# EAGLE schematic atmega16 (EAGLE 7.1.0)
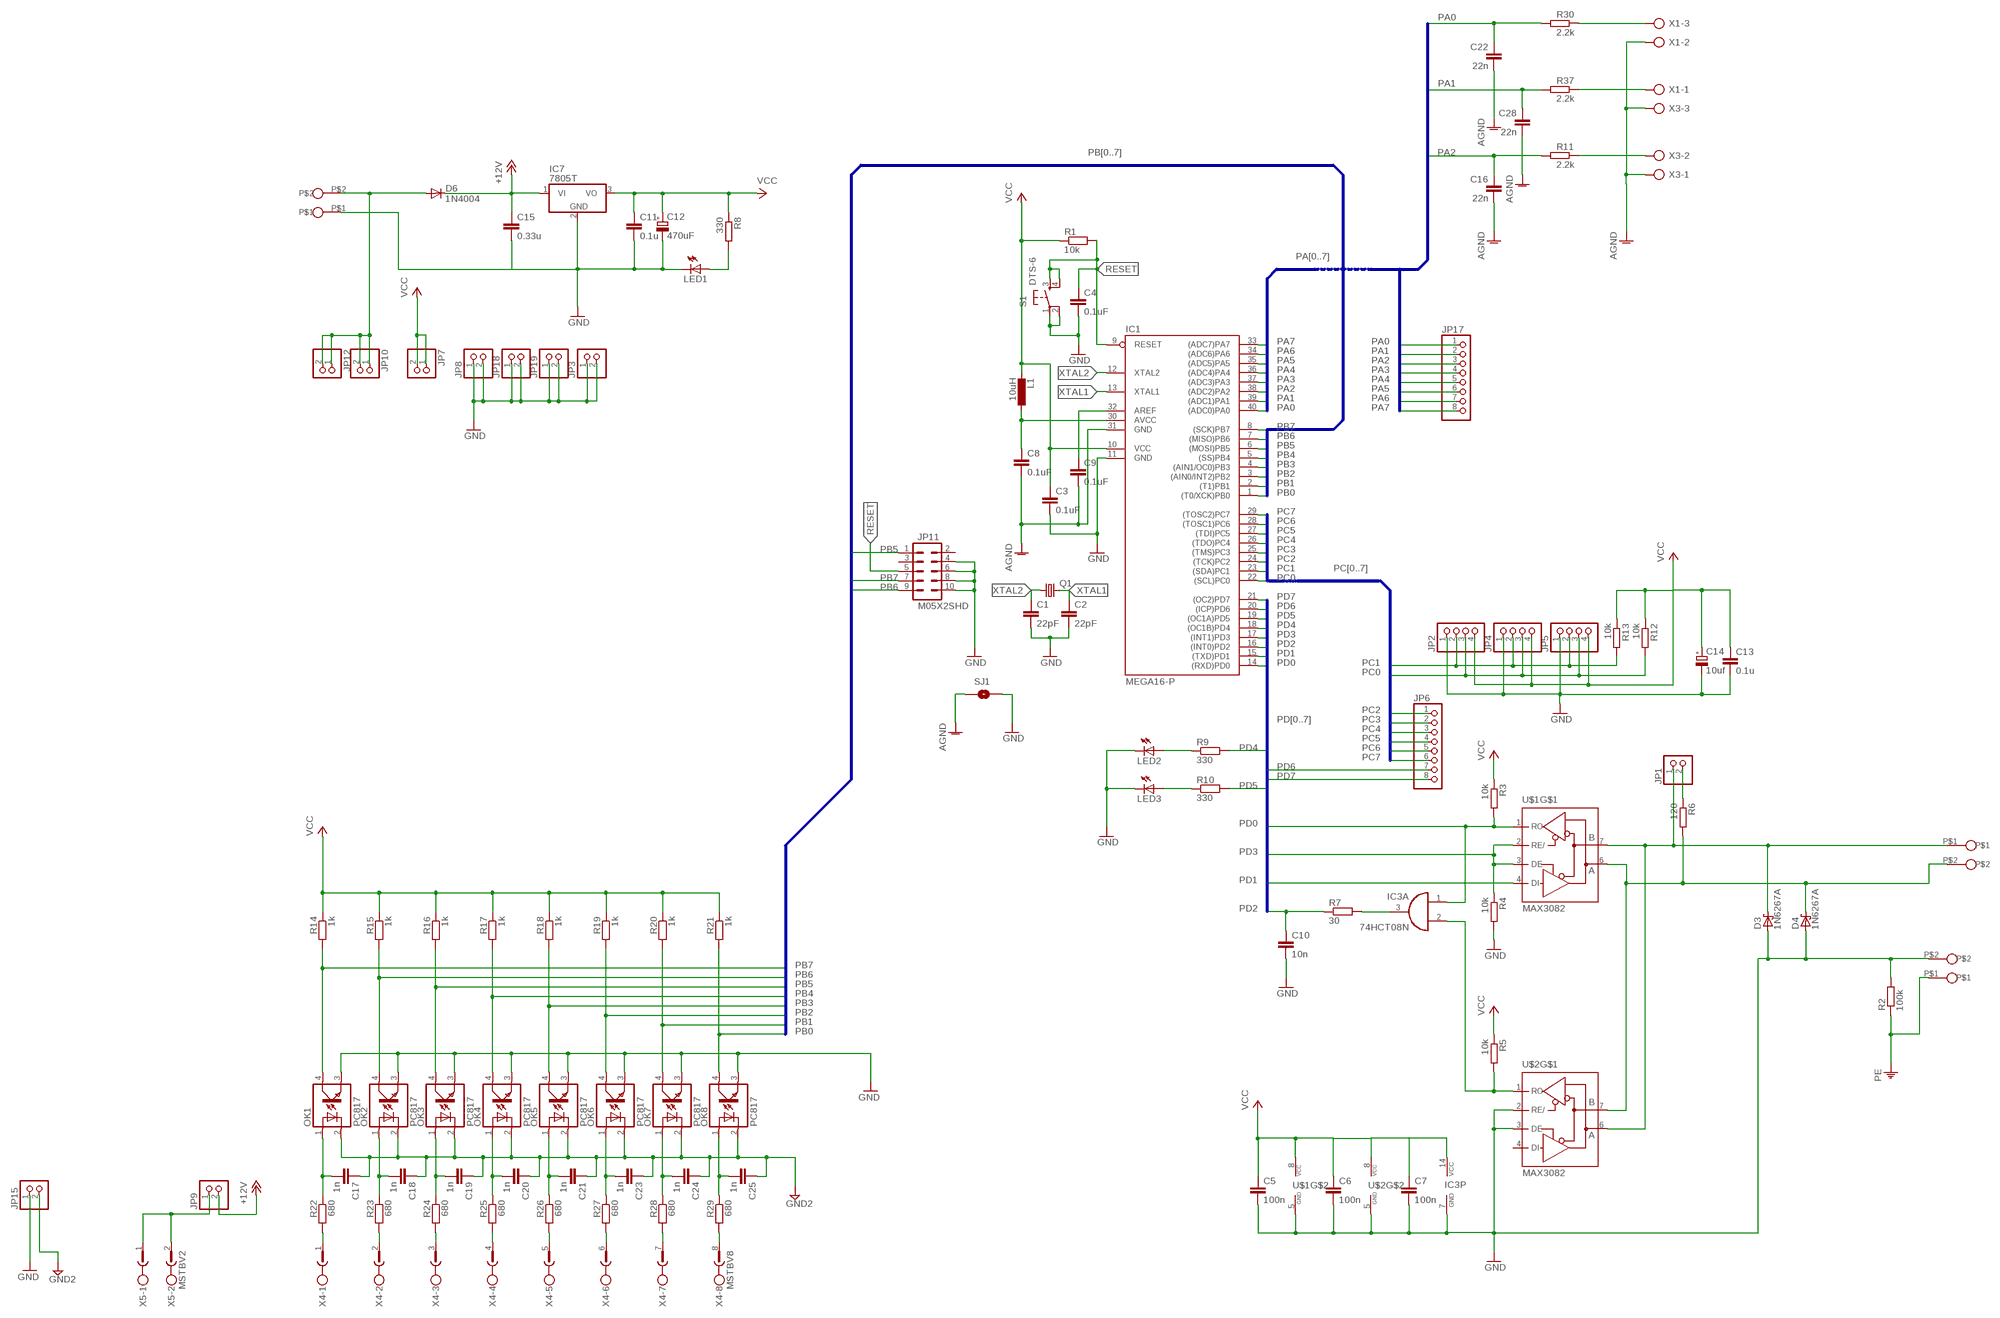
[diagram p0: schematic, sheet 1]

## Parts
C1  22pF  C-EU050-024X044  [C050-024X044]
C2  22pF  C-EU050-024X044  [C050-024X044]
C3  0.1uF  C-EU050-025X075  [C050-025X075]
C4  0.1uF  C-EU050-025X075  [C050-025X075]
C5  100n  C-EU050-035X075  [C050-035X075]
C6  100n  C-EU050-035X075  [C050-035X075]
C7  100n  C-EU050-035X075  [C050-035X075]
C8  0.1uF  C-EU050-025X075  [C050-025X075]
C9  0.1uF  C-EU050-025X075  [C050-025X075]
C10  10n  C-EU050-035X075  [C050-035X075]
C11  0.1u  C-EU025-024X044  [C025-024X044]
C12  470uF  CPOL-EUE5-10.5  [E5-10,5]
C13  0.1u  C-EU025-024X044  [C025-024X044]
C14  10uf  CPOL-EUE2-4  [E2-4]
C15  0.33u  C-EU025-024X044  [C025-024X044]
C16  22n  C-EU050-025X075  [C050-025X075]
C17  1n  C-EU050-025X075  [C050-025X075]
C18  1n  C-EU050-025X075  [C050-025X075]
C19  1n  C-EU050-025X075  [C050-025X075]
C20  1n  C-EU050-025X075  [C050-025X075]
C21  1n  C-EU050-025X075  [C050-025X075]
C22  22n  C-EU050-025X075  [C050-025X075]
C23  1n  C-EU050-025X075  [C050-025X075]
C24  1n  C-EU050-025X075  [C050-025X075]
C25  1n  C-EU050-025X075  [C050-025X075]
C28  22n  C-EU050-025X075  [C050-025X075]
D3  1N6267A  [C4111-15]
D4  1N6267A  [C4111-15]
D6  1N4004  [DO41-10]
IC1  MEGA16-P  [DIL40]
IC3  74HCT08N  [DIL14]
IC7  7805T  [TO220H]
JP1  PINHD-1X2  [1X02]
JP2  PINHD-1X4  [1X04]
JP3  PINHD-1X2  [1X02]
JP4  PINHD-1X4  [1X04]
JP5  PINHD-1X4  [1X04]
JP6  PINHD-1X8  [1X08]
JP7  PINHD-1X2  [1X02]
JP8  PINHD-1X2  [1X02]
JP9  PINHD-1X2  [1X02]
JP10  PINHD-1X2  [1X02]
JP11  M05X2SHD  [2X5-SHROUDED]
JP12  PINHD-1X2  [1X02]
JP15  PINHD-1X2  [1X02]
JP17  PINHD-1X8  [1X08]
JP18  PINHD-1X2  [1X02]
JP19  PINHD-1X2  [1X02]
L1  10uH  L-EU0207/12  [0207/12]
LED1  LED3MM  [LED3MM]
LED2  LED3MM  [LED3MM]
LED3  LED3MM  [LED3MM]
OK1  PC817  [DIL04]
OK2  PC817  [DIL04]
OK3  PC817  [DIL04]
OK4  PC817  [DIL04]
OK5  PC817  [DIL04]
OK6  PC817  [DIL04]
OK7  PC817  [DIL04]
OK8  PC817  [DIL04]
Q1  CRYSTALHC49U70  [HC49U70]
R1  10k  R-EU_0204/7  [0204/7]
R2  100k  R-EU_0204/7  [0204/7]
R3  10k  R-EU_0204/7  [0204/7]
R4  10k  R-EU_0204/7  [0204/7]
R5  10k  R-EU_0204/7  [0204/7]
R6  120  R-EU_0204/7  [0204/7]
R7  30  R-EU_0207/10  [0207/10]
R8  330  R-EU_0204/7  [0204/7]
R9  330  R-EU_0204/7  [0204/7]
R10  330  R-EU_0204/7  [0204/7]
R11  2.2k  R-EU_0204/7  [0204/7]
R12  10k  R-EU_0204/7  [0204/7]
R13  10k  R-EU_0204/7  [0204/7]
R14  1k  R-EU_0204/7  [0204/7]
R15  1k  R-EU_0204/7  [0204/7]
R16  1k  R-EU_0204/7  [0204/7]
R17  1k  R-EU_0204/7  [0204/7]
R18  1k  R-EU_0204/7  [0204/7]
R19  1k  R-EU_0204/7  [0204/7]
R20  1k  R-EU_0204/7  [0204/7]
R21  1k  R-EU_0204/7  [0204/7]
R22  680  R-EU_0204/7  [0204/7]
R23  680  R-EU_0204/7  [0204/7]
R24  680  R-EU_0204/7  [0204/7]
R25  680  R-EU_0204/7  [0204/7]
R26  680  R-EU_0204/7  [0204/7]
R27  680  R-EU_0204/7  [0204/7]
R28  680  R-EU_0204/7  [0204/7]
R29  680  R-EU_0204/7  [0204/7]
R30  2.2k  R-EU_0204/7  [0204/7]
R37  2.2k  R-EU_0204/7  [0204/7]
S1  DTS-6  [DTS-6]
SJ1  SOLDERJUMPERTRACE  [SJ_2S-TRACE]
U$1  MAX3082  [DIL08]
U$2  MAX3082  [DIL08]
U$3  TM-2  [CON-2]
U$4  TM-2  [CON-2]
U$5  TM-2  [CON-2]
X1  AK500/3  [AK500/3]
X3  AK500/3  [AK500/3]
X4  MSTBV8  [MSTBV8]
X5  MSTBV2  [MSTBV2]

## Nets
+12V: C15.1 D6.C IC7.1(VI) JP9.2
AGND: C8.2 C9.2 C16.2 C22.2 C28.2 IC1.31(GND) SJ1.1 X1.2 X3.1 X3.3
GND: C1.2 C2.2 C3.2 C4.2 C5.2 C6.2 C7.2 C10.2 C11.2 C12.- C13.2 C14.- C15.2 D3.A D4.A IC1.11(GND) IC3.7(P:GND) IC7.2(GND) JP2.1 JP3.1 JP3.2 JP4.1 JP5.1 JP8.1 JP8.2 JP11.4 JP11.6 JP11.8 JP11.10 JP15.1 JP18.1 JP18.2 JP19.1 JP19.2 LED1.K(C) LED2.K(C) LED3.K(C) OK1.3(EMIT) OK2.3(EMIT) OK3.3(EMIT) OK4.3(EMIT) OK5.3(EMIT) OK6.3(EMIT) OK7.3(EMIT) OK8.3(EMIT) R2.2 R4.2 S1.1 S1.2 SJ1.2 U$1.5(GND) U$2.2(RE/) U$2.3(DE) U$2.5(GND) U$4.P$2 U$5.P$1
GND2: C17.1 C18.1 C19.1 C20.1 C21.1 C23.1 C24.1 C25.1 JP15.2 OK1.2(C) OK2.2(C) OK3.2(C) OK4.2(C) OK5.2(C) OK6.2(C) OK7.2(C) OK8.2(C)
N$1: JP1.2 R6.1
N$2: D4.C R6.2 U$1.6(A) U$2.7(B) U$3.P$2
N$3: IC3.2(A:I1) R5.2 U$2.1(RO)
N$4: LED1.A R8.2
N$5: R30.1 X1.3
N$6: LED3.A R10.1
N$7: IC3.3(A:O) R7.2
N$8: C8.1 IC1.30(AVCC) L1.1
N$9: D3.C JP1.1 U$1.7(B) U$2.6(A) U$3.P$1
N$10: R37.1 X1.1
N$11: JP9.1 X5.1 X5.2
N$12: D6.A JP10.1 JP10.2 JP12.1 JP12.2 U$5.P$2
N$14: R11.1 X3.2
N$15: C9.1 IC1.32(AREF)
N$20: R22.2 X4.1
N$21: R26.2 X4.5
N$22: R27.2 X4.6
N$23: R28.2 X4.7
N$24: R29.2 X4.8
N$25: R23.2 X4.2
N$26: R24.2 X4.3
N$27: R25.2 X4.4
N$28: LED2.A R9.1
N$29: C17.2 OK1.1(A) R22.1
N$30: C18.2 OK2.1(A) R23.1
N$31: C19.2 OK3.1(A) R24.1
N$32: C20.2 OK4.1(A) R25.1
N$33: C21.2 OK5.1(A) R26.1
N$34: C23.2 OK6.1(A) R27.1
N$35: C24.2 OK7.1(A) R28.1
N$36: C25.2 OK8.1(A) R29.1
PA0: C22.1 IC1.40((ADC0)PA0) JP17.1 R30.2
PA1: C28.1 IC1.39((ADC1)PA1) JP17.2 R37.2
PA2: C16.1 IC1.38((ADC2)PA2) JP17.3 R11.2
PA3: IC1.37((ADC3)PA3) JP17.4
PA4: IC1.36((ADC4)PA4) JP17.5
PA5: IC1.35((ADC5)PA5) JP17.6
PA6: IC1.34((ADC6)PA6) JP17.7
PA7: IC1.33((ADC7)PA7) JP17.8
PB0: IC1.1((T0/XCK)PB0) OK8.4(COL) R21.2
PB1: IC1.2((T1)PB1) OK7.4(COL) R20.2
PB2: IC1.3((AIN0/INT2)PB2) OK6.4(COL) R19.2
PB3: IC1.4((AIN1/OC0)PB3) OK5.4(COL) R18.2
PB4: IC1.5((SS)PB4) OK4.4(COL) R17.2
PB5: IC1.6((MOSI)PB5) JP11.1 OK3.4(COL) R16.2
PB6: IC1.7((MISO)PB6) JP11.9 OK2.4(COL) R15.2
PB7: IC1.8((SCK)PB7) JP11.7 OK1.4(COL) R14.2
PC0: IC1.22((SCL)PC0) JP2.3 JP4.3 JP5.3 R12.2
PC1: IC1.23((SDA)PC1) JP2.2 JP4.2 JP5.2 R13.2
PC2: IC1.24((TCK)PC2) JP6.1
PC3: IC1.25((TMS)PC3) JP6.2
PC4: IC1.26((TDO)PC4) JP6.3
PC5: IC1.27((TDI)PC5) JP6.4
PC6: IC1.28((TOSC1)PC6) JP6.5
PC7: IC1.29((TOSC2)PC7) JP6.6
PD0: IC1.14((RXD)PD0) IC3.1(A:I0) R3.2 U$1.1(RO)
PD1: IC1.15((TXD)PD1) U$1.4(DI)
PD2: C10.1 IC1.16((INT0)PD2) R7.1
PD3: IC1.17((INT1)PD3) R4.1 U$1.2(RE/) U$1.3(DE)
PD4: IC1.18((OC1B)PD4) R9.2
PD5: IC1.19((OC1A)PD5) R10.2
PD6: IC1.20((ICP)PD6) JP6.7
PD7: IC1.21((OC2)PD7) JP6.8
PE: R2.1 U$4.P$1
RESET: C4.1 IC1.9(RESET) JP11.5 R1.2 S1.3 S1.4
VCC: C3.1 C5.1 C6.1 C7.1 C11.1 C12.+ C13.1 C14.+ IC1.10(VCC) IC3.14(P:VCC) IC7.3(VO) JP2.4 JP4.4 JP5.4 JP7.1 JP7.2 L1.2 R1.1 R3.1 R5.1 R8.1 R12.1 R13.1 R14.1 R15.1 R16.1 R17.1 R18.1 R19.1 R20.1 R21.1 U$1.8(VCC) U$2.8(VCC)
XTAL1: C2.1 IC1.13(XTAL1) Q1.2
XTAL2: C1.1 IC1.12(XTAL2) Q1.1
Unconnected: IC3.4(B:I0) IC3.5(B:I1) IC3.6(B:O) IC3.8(C:O) IC3.9(C:I0) IC3.10(C:I1) IC3.11(D:O) IC3.12(D:I0) IC3.13(D:I1) JP11.2 JP11.3 U$2.4(DI)

## Buses
PB[0..7]
PD[0..7]
PA[0..7]
PC[0..7]

## Library data of the parts
C1-C11 C13 C15-C25 C28 = rcl:C-EU: CAPACITOR, European symbol
C12 C14 = rcl:CPOL-EU: POLARIZED CAPACITOR, European symbol
D3 D4 = diode:1N6267A: DIODE transient voltage suppressor
D6 = diode:1N4004: DIODE general purpose rectifier, 1 A
IC1 = atmel:MEGA16-P: MICROCONTROLLER 16 Kbytes FLASH 1 kbytes SRAM 512 bytes EEPROM USART 8-channel 10 bit ADC Source: avr.lbr; MPN: ATMEGA16-16PU; OC_FARNELL: 9171142; OC_NEWARK: 01M6885
IC3 = 74xx-eu:74*08: Quad 2-input AND gate
IC7 = linear:78*: Positive VOLTAGE REGULATOR Source: http://cache.national.com/ds/LM/LM78L05.pdf http://www.fairchildsemi.com/ds/LM/LM7805.pdf
JP1 JP3 JP7-JP10 JP12 JP15 JP18 JP19 = pinhead:PINHD-1X2: PIN HEADER
JP2 JP4 JP5 = pinhead:PINHD-1X4: PIN HEADER
JP6 JP17 = pinhead:PINHD-1X8: PIN HEADER
JP11 = SparkFun:M05X2: Header 5x2 Standard 10-pin dual row 0.1" header. Commonly used with AVR-ISP. Use with Spark Fun Electronics SKU: PRT-00778
L1 = rcl:L-EU: INDUCTOR, European symbol
LED1-LED3 = led:LED: LED OSRAM: - CHIPLED LG R971, LG N971, LY N971, LG Q971, LY Q971, LO R971, LY R971 LH N974, LH R974 LS Q976, LO Q976, LY Q976 LO Q996 - Hyper CHIPLED LW Q18S LB Q993, LB Q99A, LB R99A - SideLED LS A670, LO A670, LY A670, LG A670, LP A670 LB A673, LV A673, LT A673, LW A673 LH A674 LY A675 LS A676, LA A676, LO A676, LY A676, LW A676 LS A679, LY A679, LG A679 - Hyper Micro SIDELED® LS Y876, LA Y876, LO Y876, LY Y876 LT Y87S - SmartLED LW L88C, LW L88S LB L89C, LB L89S, LG L890 LS L89K, LO L89K, LY L89K LS L896, LA L896, LO L896, LY L896 - TOPLED LS T670, LO T670, LY T670, LG T670, LP T670 LSG T670, LSP T670, LSY T670, LOP T670, LYG T670 LG T671, LOG T671, LSG T671 LB T673, LV T673, LT T673, LW T673 LH T674 LS T676, LA T676, LO T676, LY T676, LB T676, LH T676, LSB T676, LW T676 LB T67C, LV T67C, LT T67C, LS T67K, LO T67K, LY T67K, LW E67C LS E67B, LA E67B, LO E67B, LY E67B, LB E67C, LV E67C, LT E67C LW T67C LS T679, LY T679, LG T679 LS T770, LO T770, LY T770, LG T770, LP T770 LB T773, LV T773, LT T773, LW T773 LH T774 LS E675, LA E675, LY E675, LS T675 LS T776, LA T776, LO T776, LY T776, LB T776 LHGB T686 LT T68C, LB T68C - Hyper Mini TOPLED® LB M676 - Mini TOPLED Santana® LG M470 LS M47K, LO M47K, LY M47K Source: http://www.osram.convergy.de LUXEON: - LUMILED® LXK2-PW12-R00, LXK2-PW12-S00, LXK2-PW14-U00, LXK2-PW14-V00 LXK2-PM12-R00, LXK2-PM12-S00, LXK2-PM14-U00 LXK2-PE12-Q00, LXK2-PE12-R00, LXK2-PE12-S00, LXK2-PE14-T00, LXK2-PE14-U00 LXK2-PB12-K00, LXK2-PB12-L00, LXK2-PB12-M00, LXK2-PB14-N00, LXK2-PB14-P00, LXK2-PB14-Q00 LXK2-PR12-L00, LXK2-PR12-M00, LXK2-PR14-Q00, LXK2-PR14-R00 LXK2-PD12-Q00, LXK2-PD12-R00, LXK2-PD12-S00 LXK2-PH12-R00, LXK2-PH12-S00 LXK2-PL12-P00, LXK2-PL12-Q00, LXK2-PL12-R00 Source: www.luxeon.com KINGBRIGHT: KA-3528ASYC Source: www.kingbright.com
OK1-OK8 = optocoupler:PC817: SHARP OPTO COUPLER; MPN: PC817X4J000F; OC_FARNELL: 9707727; OC_NEWARK: 97K7059
Q1 = crystal:CRYSTAL: CRYSTAL; OC_FARNELL: unknown; OC_NEWARK: unknown
R1 R7-R11 R14-R30 R37 = rcl:R-EU_: RESISTOR, European symbol
R2-R6 R12 R13 = resistor:R-EU_: RESISTOR, European symbol
S1 = switch-tact:DTS-6
SJ1 = SparkFun:SOLDERJUMPER: Solder Jumper Standard SMD solder jumper. Used to automate production. Two varients : Normally Open and Normally Closed are the same, but have different paste layers. NC will have a large amount of paste and should jumper during reflow.
U$1 U$2 = maxim:MAX3082
U$3-U$5 = connetors_my:TM-2
X1 X3 = con-ptr500:AK500/3: CONNECTOR; OC_FARNELL: unknown; OC_NEWARK: unknown
X4 = con-phoenix-508:MSTBV8: PHOENIX
X5 = con-phoenix-508:MSTBV2: PHOENIX